# Altium schematic sheet DB10012_ControlIOConnector.SchDoc: Header layour - TODO
size A4; SheetNumber: 6; SheetTotal: 6
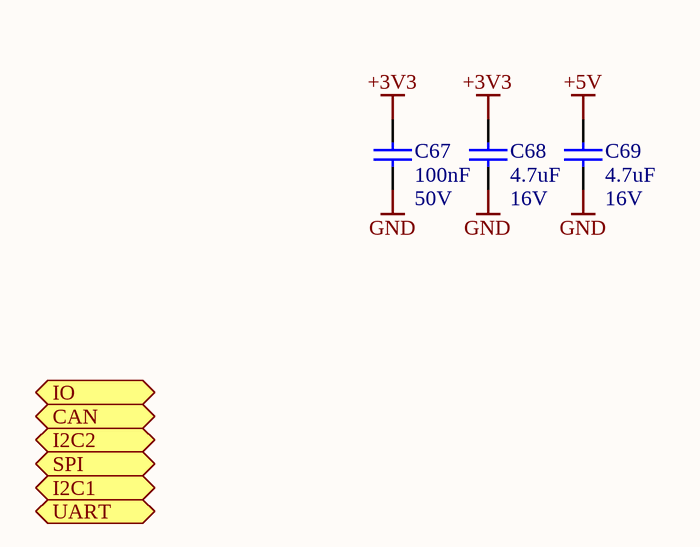
[diagram p0: DB10012_ControlIOConnector.SchDoc]

## Parts
C67  100nF  Voltage Rating: 50V  [C-0805]
C68  4.7uF  Voltage Rating: 16V  [C-0805]
C69  4.7uF  Voltage Rating: 16V  [C-0805]

## Ports
CAN (harness CAN), I2C1 (harness I2C1), I2C2 (harness I2C3), IO (harness IO), SPI (harness SPI), UART (harness UART)

## Nets
+3V3: C67.2 C68.2
+5V: C69.2
GND: C67.1 C68.1 C69.1

## Notes on the sheet
- Title
- Size:
- Date:
- A4
- Number:
- Time:
- Revision:
- Sheet
- of
- File:

## Library data of the parts
C67 = 100nF/0805/CER/50V: Capacitor, 100nF, 50V,  X7R; Capacitance Tolerance: ± 10%; Capacitor Case Style: 0805; Brand Number: C0805C104K5RACTU; Brand: KEMET; Dielectric Characteristic: X7R; Capacitance: 100nF; Temperature Range: -55°C to +125°C; Price: 0,022; Order Code Supplier: 1414664; Supplier: Farnell
C68 C69 = 4.7uF/0805/CER/16V: Capacitor, 4.7uF, 16V, X7R; Capacitance Tolerance: ± 10%; Capacitor Case Style: 0805; Brand Number: GRM21BR71C475KA73L; Brand: MURATA; Dielectric Characteristic: X7R; Capacitance: 4.7uF; Temperature Range: -55°C to +125°C; Price: 0,26; Order Code Supplier: 1797015; Supplier: Farnell